# EAGLE design SingleNixie (EAGLE 7.4.0)
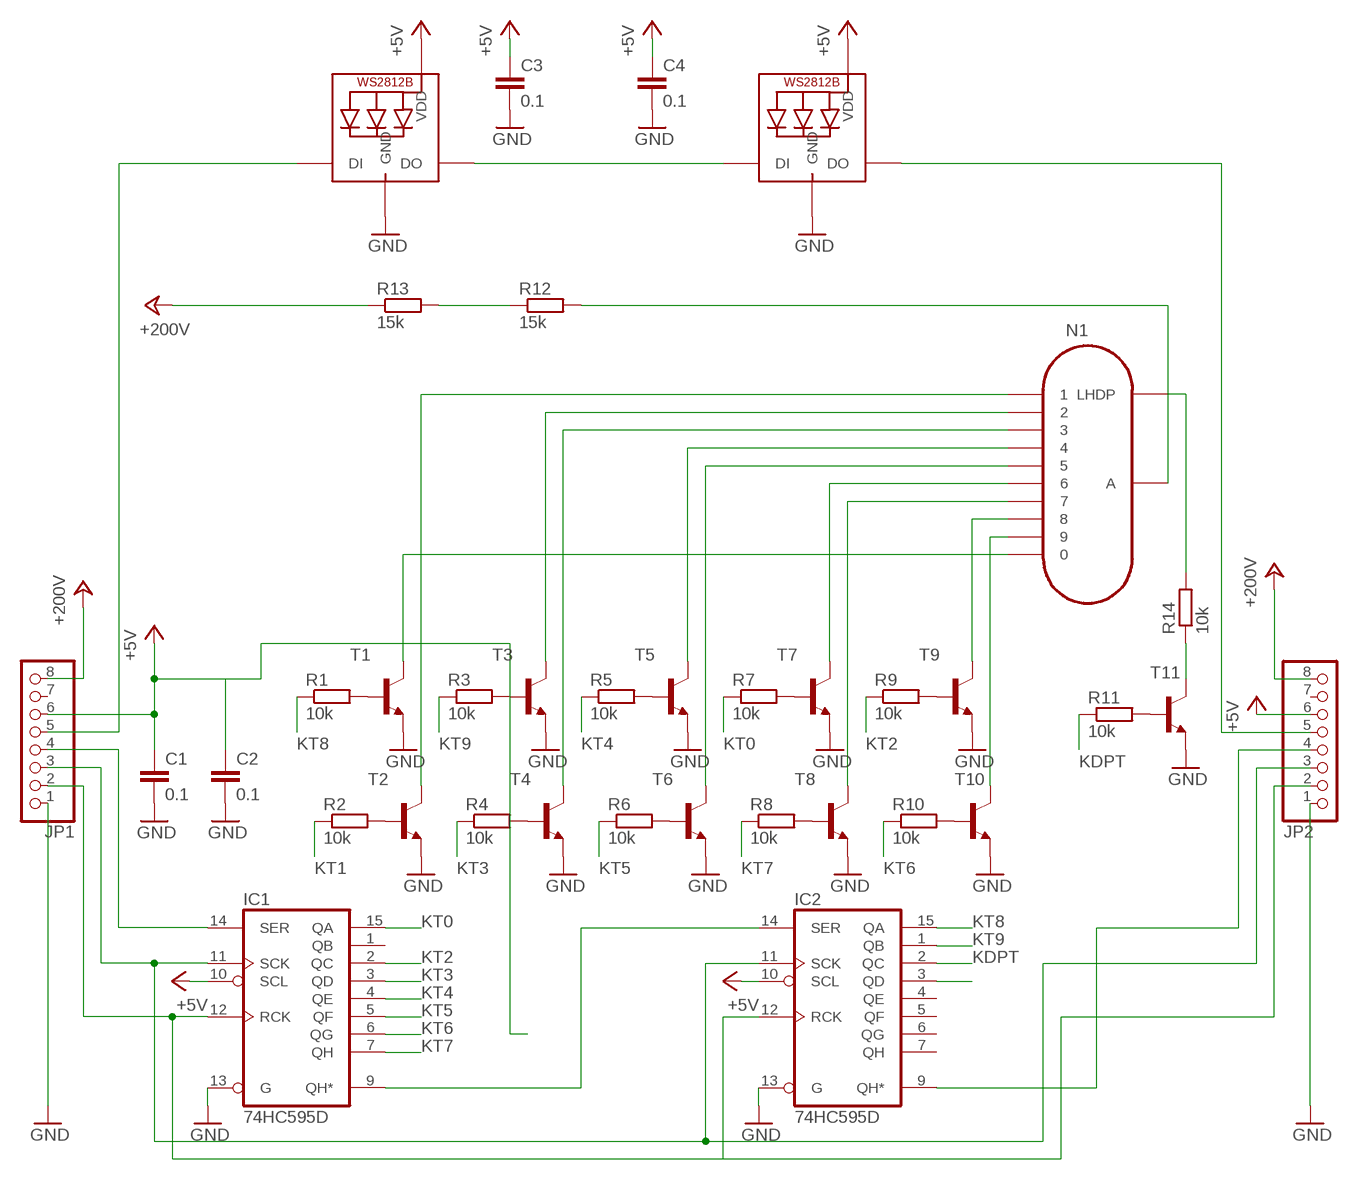
[diagram p0: schematic, sheet 1]

## Parts
C1  0.1  C-EUC0805  [C0805]
C2  0.1  C-EUC0805  [C0805]
C3  0.1  C-EUC0805  [C0805]
C4  0.1  C-EUC0805  [C0805]
IC1  74HC595D  [SO16]
IC2  74HC595D  [SO16]
JP1  HEADER-1X8ROUND  [1X08_ROUND]
JP2  HEADER-1X8ROUND  [1X08_ROUND]
LED1  WS2812B3535  [LED3535]
LED2  WS2812B3535  [LED3535]
N1  IN-12B1.5MM  [IN-12-1.5]
R1  10k  R-EU_R0805  [R0805]
R2  10k  R-EU_R0805  [R0805]
R3  10k  R-EU_R0805  [R0805]
R4  10k  R-EU_R0805  [R0805]
R5  10k  R-EU_R0805  [R0805]
R6  10k  R-EU_R0805  [R0805]
R7  10k  R-EU_R0805  [R0805]
R8  10k  R-EU_R0805  [R0805]
R9  10k  R-EU_R0805  [R0805]
R10  10k  R-EU_R0805  [R0805]
R11  10k  R-EU_R0805  [R0805]
R12  15k  R-EU_R0805  [R0805]
R13  15k  R-EU_R0805  [R0805]
R14  10k  R-EU_R0805  [R0805]
T1  MMBTA42LT1-NPN-SOT23-BEC  [SOT23-BEC]
T2  MMBTA42LT1-NPN-SOT23-BEC  [SOT23-BEC]
T3  MMBTA42LT1-NPN-SOT23-BEC  [SOT23-BEC]
T4  MMBTA42LT1-NPN-SOT23-BEC  [SOT23-BEC]
T5  MMBTA42LT1-NPN-SOT23-BEC  [SOT23-BEC]
T6  MMBTA42LT1-NPN-SOT23-BEC  [SOT23-BEC]
T7  MMBTA42LT1-NPN-SOT23-BEC  [SOT23-BEC]
T8  MMBTA42LT1-NPN-SOT23-BEC  [SOT23-BEC]
T9  MMBTA42LT1-NPN-SOT23-BEC  [SOT23-BEC]
T10  MMBTA42LT1-NPN-SOT23-BEC  [SOT23-BEC]
T11  MMBTA42LT1-NPN-SOT23-BEC  [SOT23-BEC]

## Nets
+5V: C1.1 C2.1 C3.1 C4.1 IC1.10(SCL) IC2.10(SCL) JP1.6 JP2.6 LED1.2(VDD) LED2.2(VDD)
+200V: JP1.8 JP2.8 R13.1
ANODE: N1.A R12.2
GND: C1.2 C2.2 C3.2 C4.2 IC1.13(G) IC2.13(G) JP1.1 JP2.1 LED1.4(GND) LED2.4(GND) T1.E T2.E T3.E T4.E T5.E T6.E T7.E T8.E T9.E T10.E T11.E
K0: N1.0 T1.C
K1: N1.1 T2.C
K2: N1.2 T3.C
K3: N1.3 T4.C
K4: N1.4 T5.C
K5: N1.5 T6.C
K6: N1.6 T7.C
K7: N1.7 T8.C
K8: N1.8 T9.C
K9: N1.9 T10.C
KDP: N1.LHDP R14.2
KDPT: IC2.2(QC) R11.1
KT0: IC1.15(QA) R7.1
KT1: IC2.3(QD) R2.1
KT2: IC1.2(QC) R9.1
KT3: IC1.3(QD) R4.1
KT4: IC1.4(QE) R5.1
KT5: IC1.5(QF) R6.1
KT6: IC1.6(QG) R10.1
KT7: IC1.7(QH) R8.1
KT8: IC2.15(QA) R1.1
KT9: IC2.1(QB) R3.1
N$1: R3.2 T3.B
N$2: R1.2 T1.B
N$3: R2.2 T2.B
N$4: R4.2 T4.B
N$5: R5.2 T5.B
N$6: R6.2 T6.B
N$7: R7.2 T7.B
N$8: R8.2 T8.B
N$9: R9.2 T9.B
N$10: R10.2 T10.B
N$11: LED1.3(DO) LED2.1(DI)
N$12: JP1.5 LED1.1(DI)
N$13: JP2.5 LED2.3(DO)
N$21: R11.2 T11.B
N$22: IC1.14(SER) JP1.4
N$23: R14.1 T11.C
N$24: R12.1 R13.2
N$25: IC1.9(QH*) IC2.14(SER)
N$26: IC1.11(SCK) IC2.11(SCK) JP1.3 JP2.3
N$27: IC1.12(RCK) IC2.12(RCK) JP1.2 JP2.2
N$28: IC2.9(QH*) JP2.4
Unconnected: IC1.1(QB) IC2.4(QE) IC2.5(QF) IC2.6(QG) IC2.7(QH) JP1.7 JP2.7

## Power pins joined to a net without a drawn wire
+5V: IC1.16(VCC) IC2.16(VCC)
GND: IC1.8(GND) IC2.8(GND)

## Library data of the parts
C1-C4 = rcl:C-EU: CAPACITOR, European symbol
IC1 IC2 = 74xx-eu:74*595: 8-bit SHIFT REGISTER, output latch
JP1 JP2 = Adafruit CP2104:HEADER-1X8: PIN HEADER
LED1 LED2 = adafruit:WS2812B
N1 = russian-nixies:IN-12B: IN-12B: medium numeric topview nixie tube
R1-R14 = resistor:R-EU_: RESISTOR, European symbol
T1-T11 = transistor-neu-to92:*-NPN-: NPN Transistror

## Board
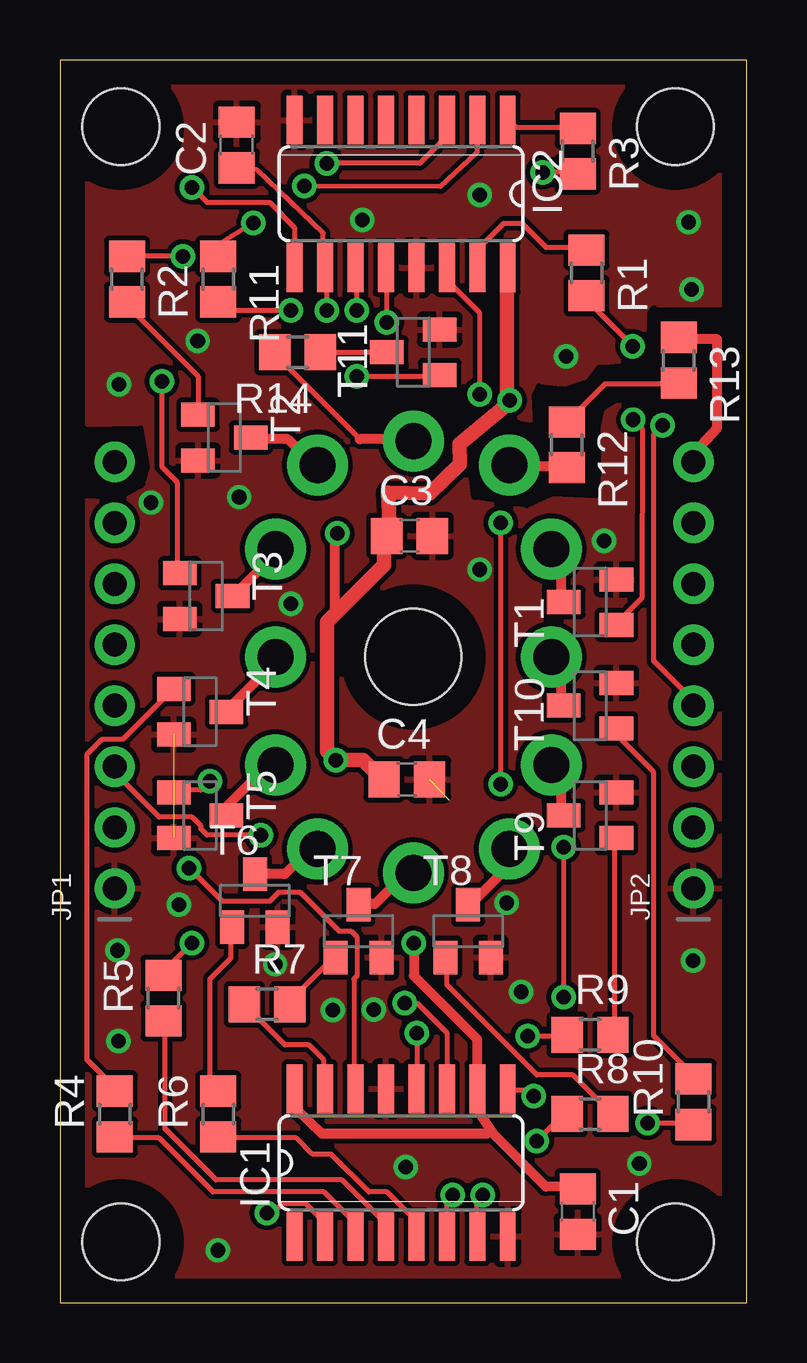
[diagram p1: board, top side]
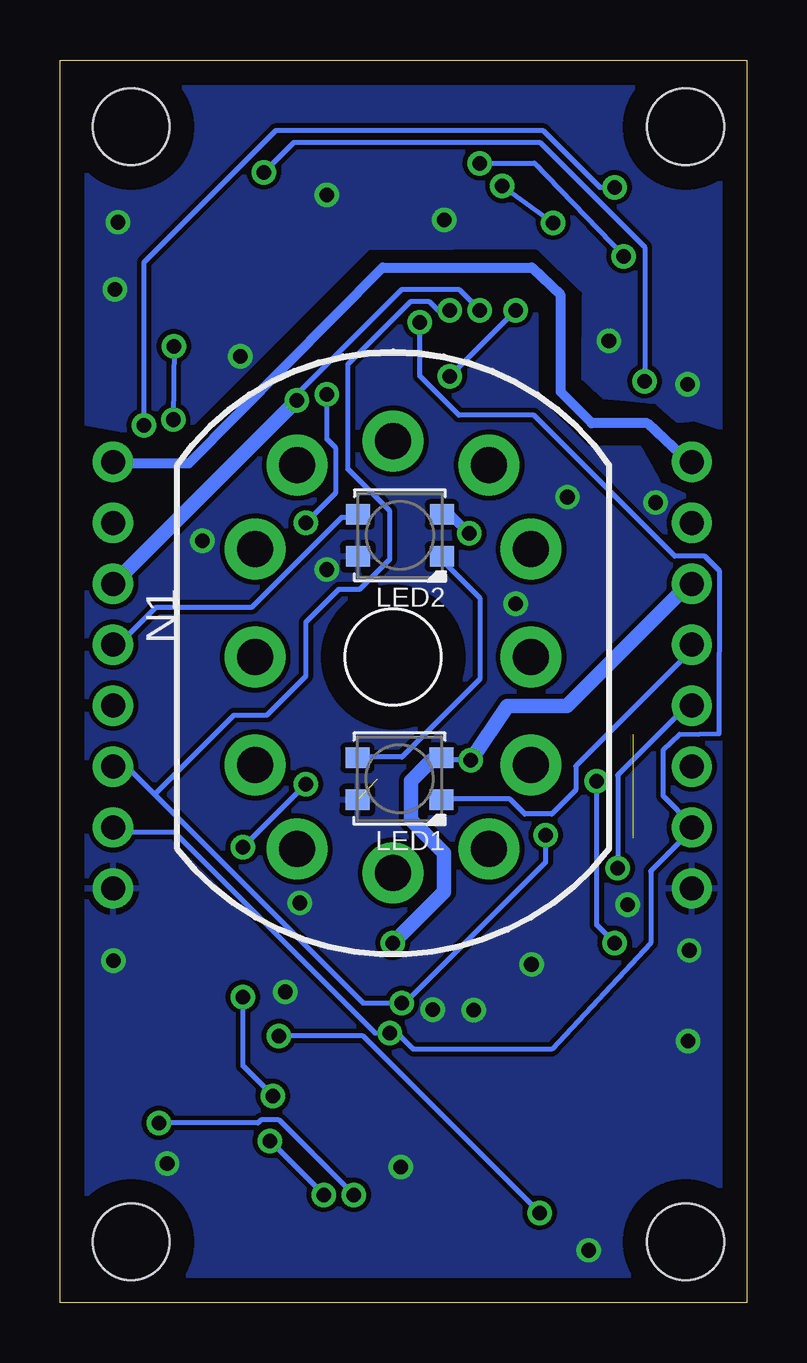
[diagram p2: board, bottom side, seen from below]

Size 28.63 x 51.81 mm. Coordinates in mm from the lower left corner, seen from the top.
Outline: 0,0 28.63,0 28.63,51.81 0,51.81 0,0
Copper layers (1*16): Top 0.035mm / dielectric 1.5mm / Bottom 0.035mm
Design rules "default *": minimum track width 8mil, minimum drill 24mil, track to track 8mil, track to pad 8mil, pad to pad 8mil, via to via 8mil, smd to smd 8mil, copper to edge 40mil, drill to drill 8mil, minimum pad ring 10mil, minimum via ring 8mil, stop-mask expansion 4mil, vias tented up to drill 0mil, thermal gap 10mil
Holes 3.2 mm at 2.54,2.54 25.65,2.54 25.65,49.02 2.54,49.02
tRestrict: area 17,33.2 to 27.6,41.5; area 0.8,33.6 to 3.6,36.4
bRestrict: area 0.8,33.7 to 27.6,43.8

### Footprints (pad centres in the part's own frame; a part is rotated, then mirrored left to right if it is on the bottom)
C0805 = smd 1.3 x 1.5: 1 -0.95,0; 2 0.95,0
SO16 = smd 0.66 x 2.032: 1 -4.445,-3.073; 2 -3.175,-3.073; 3 -1.905,-3.073; 4 -0.635,-3.073; 5 0.635,-3.073; 6 1.905,-3.073; 7 3.175,-3.073; 8 4.445,-3.073; 9 4.445,3.073; 10 3.175,3.073; 11 1.905,3.073; 12 0.635,3.073; 13 -0.635,3.073; 14 -1.905,3.073; 15 -3.175,3.073; 16 -4.445,3.073
1X08_ROUND = drill 1 pad 1.676: 1 -8.89,0; 2 -6.35,0; 3 -3.81,0; 4 -1.27,0; 5 1.27,0; 6 3.81,0; 7 6.35,0; 8 8.89,0
LED3535 = smd 1 x 0.85: 1 -1.75,0.875; 2 -1.75,-0.875; 3 1.75,-0.875; 4 1.75,0.875
IN-12-1.5 = drill 1.5 pad 2.54: 0 5.75,-4.5; 1 -4,-8; 2 -5.75,-4.5; 3 -5.75,0; 4 -5.75,4.5; 5 -4,8; 6 0,9; 7 4,8; 8 5.75,4.5; 9 5.75,0; A 4,-8; LHDP 0,-9 | hole 4: 0,0
R0805 = smd 1.3 x 1.5: 1 -0.95,0; 2 0.95,0
SOT23-BEC = smd 1 x 1.4: B -0.95,-1.1; C 0,1.1; E 0.95,-1.1

### Placement (x,y rotation side)
C1  21.59,3.81 270 top
C2  7.37,48.26 90 top
C3  14.57,31.97 0 top
C4  14.46,21.82 0 top
IC1  14.22,5.84 0 top
IC2  14.22,46.23 180 top
JP1  2.29,26.16 90 top
JP2  26.42,26.16 90 top
LED1  14.47,21.84 180 bottom
LED2  14.45,31.99 180 bottom
N1  14.73,26.92 180 bottom
R1  21.95,42.93 270 top
R2  2.79,42.67 270 top
R3  21.59,48.01 270 top
R4  2.29,7.87 90 top
R5  4.32,12.7 90 top
R6  6.6,7.87 90 top
R7  8.64,12.45 0 top
R8  22.1,7.87 0 top
R9  22.1,11.18 0 top
R10  26.42,8.38 90 top
R11  6.6,42.67 270 top
R12  21.13,35.76 270 top
R13  25.79,39.29 270 top
R14  9.91,39.62 180 top
T1  22.1,29.21 90 top
T2  6.86,36.07 270 top
T3  6.1,29.46 270 top
T4  5.84,24.64 270 top
T5  5.84,20.32 270 top
T6  8.13,16.76 0 top
T7  12.45,15.49 0 top
T8  17.02,15.49 0 top
T9  22.1,20.32 90 top
T10  22.1,24.89 90 top
T11  14.73,39.62 90 top

### Tracks (layer width: path | path; a pad name or v marks a point on that pad's centre or on a via)
+5V  (via drill 0.61)
  Top 0.203: C2.1 7.38,47.25 8.21,47.23 10.97,44.58 11,43.25 IC2.10 11.12,43.12 v11.12,41.38 | 13.62,32 13.75,32.12 13.49,32.07 C3.1 13.65,32.07 13.5,31.88 | 18.62,37.75 18.62,37.43 18.62,37.62 v18.75,37.62 | 18.62,43.12 IC2.16 | 21.5,4.88 C1.1 | 17.5,8.88 IC1.10 17.38,9 | 9.88,8.05 9.88,8.88 IC1.16 | 17.82,7.05 18.06,7.06 | 13.5,21.75 C4.1
  Top 0.406: 21.5,4.88 20.25,4.85 18.06,7.06 17.5,7.88 17.5,8.88 | 9.88,8.05 10.92,7.05 17.82,7.05 | 17.38,9 17.38,11 14.75,13.63 v14.75,15 | v11.57,32.07 11.44,31.95 11.44,28.69
  Top 0.61: 13.75,32.12 13.67,33.77 15.41,33.74 16.68,34.96 16.66,35.8 18.62,37.43 | 18.62,37.75 18.62,43.12 | 13.5,21.75 12.62,22.62 v11.5,22.62 11.12,23 11.12,28.38 11.44,28.69 13.5,30.75 13.5,31.88
  Bottom 0.203: 12.75,32.88 LED2.2 | 26.38,30 JP2.6 | v11.12,41.38 12,42.25 14.38,42.25 18.75,37.88 v18.75,37.62 | v11.5,22.62 12.62,22.62 LED1.2 12.75,22.62 13.12,22.62 | 2.38,30 JP1.6
  Bottom 0.406: v11.57,32.07 12.36,32.86 LED2.2
  Bottom 0.61: v18.75,37.62 26.38,30 | v11.5,22.62 9.97,24.88 7.5,24.88 2.38,30 | v14.75,15 12.62,17.12 12.62,18.75 14,20.12 14,21.75 13.12,22.62
+200V
  Top 0.203: 25.9,40.16 R13.1 | 26.5,35.12 JP2.8
  Top 0.406: 25.9,40.16 27.4,40.16 27.4,36.48 26.5,35.5 26.5,35.12
  Bottom 0.203: 2.38,35 JP1.8 | 26.38,35 JP2.8
  Bottom 0.406: 2.38,35 4.14,36.67 6.46,36.67 7.75,37.96 7.75,42 8.96,43.16 15.17,43.16 23.25,35 26.38,35
ANODE
  Top 0.203: 21.12,34.88 R12.2 | 18.75,34.88 N1.A
  Top 0.406: 18.75,34.88 21.12,34.88
GND  (via drill 0.61)  (2 unrouted)
  other vias: 14.41,5.65 13.08,12.23 11.38,12.2 8.97,14.11 4.95,16.6 2.44,10.91 2.39,14.69 6.58,2.19 24.16,5.8 19.23,12.96 18.62,16.67 26.39,14.26 21.11,39.46 26.21,45.04 26.34,42.25 7.47,33.59 9.63,29.14 2.46,38.29 5.74,40.09 22.68,31.76 17.5,30.57 12.6,45.14 17.5,46.19 3.79,33.36
  pour Bottom: 0.25,0.25 28.45,0.25 28.45,51.56 0.25,51.56
  pour Top: 0.47,0.49 28.18,0.65 28.25,51.3 0.38,51.37 0.36,0.72
K0
  Top 0.203: 20.88,29.25 T1.C | 20.5,31.38 N1.0
  Top 0.406: 20.88,29.25 20.88,31 20.5,31.38
K1
  Top 0.203: 8,36 T2.C | 10.62,34.88 N1.1
  Top 0.406: 8,36 9.5,36 10.62,34.88
K2
  Top 0.203: 7.25,29.5 T3.C | 8.88,31.38 N1.2
  Top 0.406: 7.25,29.5 8.88,31.12 8.88,31.38
K3
  Top 0.203: 7,24.75 T4.C | 8.88,26.88 N1.3
  Top 0.406: 7,24.75 8.88,26.62 8.88,26.88
K4
  Top 0.203: 7,20.75 7,20.38 T5.C | 8.88,22.38 N1.4
  Top 0.406: 7,20.75 8.62,22.38 8.88,22.38
K5
  Top 0.203: 10.62,18.88 10.38,18.88 | 8.25,17.88 T6.C
  Top 0.406: 8.25,17.88 9.38,17.88 10.38,18.88 | 10.62,18.88 N1.5
K6
  Top 0.203: 12.5,16.62 T7.C
  Top 0.406: 12.5,16.62 13.12,16.62 14.38,17.88 14.62,17.88 N1.6
K7
  Top 0.203: 17.12,16.62 T8.C | 18.62,18.88 N1.7
  Top 0.406: 17.12,16.62 18.62,18.12 18.62,18.88
K8
  Top 0.203: 20.88,20.38 T9.C | 20.5,22.38 N1.8
  Top 0.406: 20.88,20.38 20.88,22 20.5,22.38
K9
  Top 0.203: 20.88,25 T10.C | 20.5,26.88 N1.9
  Top 0.406: 20.88,25 20.88,26.5 20.5,26.88
KDP
  Top 0.203: 12.5,36 9,39.5 R14.2 | 14.62,36 N1.LHDP
  Top 0.406: 14.62,36 12.5,36
KDPT  (via drill 0.61)
  Top 0.203: v8.07,45.02 6.59,44.11 6.62,43.62 R11.1 | v10.19,46.55 15.87,46.53 17.38,47.94 17.38,49.25 IC2.2
  Bottom 0.203: v10.19,46.55 v8.07,45.02
KT0
  Top 0.203: R7.1 7.75,12.38 9.38,10.75 10.38,10.75 11,10.12 11,9 IC1.15
KT1  (via drill 0.61)
  Top 0.203: v5.12,43.62 2.88,43.62 R2.1 | v11.12,47.5 15,47.5 16.12,48.62 16.12,49.25 IC2.3
  Bottom 0.203: v5.12,43.62 8.85,47.51 v11.12,47.5
KT2  (via drill 0.61)
  Top 0.203: v19.5,11.12 21.12,11.12 R9.1 | v8.62,3.75 8.88,3.75 9.25,4.12 10.25,4.12 11,3.38 11,2.88 IC1.2
  Bottom 0.203: v19.5,11.12 16,11.12 v8.62,3.75
KT3
  Top 0.203: R4.1 2.38,6.88 4.12,6.88 6.38,4.62 11,4.62 12.25,3.38 12.25,2.88 IC1.3
KT4
  Top 0.203: R5.1 4.38,11.75 4.38,7.25 6.5,5.12 11.75,5.12 13.5,3.38 13.5,2.88 IC1.4
KT5
  Top 0.203: R6.1 6.62,6.88 9.86,6.88 10.54,6.2 11.3,6.2 12.88,4.62 13.62,4.62 14.75,3.5 14.75,2.88 IC1.5
KT6  (via drill 0.61)
  Top 0.203: v24.5,7.5 26.38,7.5 R10.1 | v16.38,4.5 16.12,4.25 16.12,2.88 IC1.6
  Bottom 0.203: v24.5,7.5 20.38,7.5 20.25,7.62 19.5,7.62 v16.38,4.5
KT7  (via drill 0.61)
  Top 0.203: v19.88,6.75 20.88,7.75 21.12,7.75 R8.1 | v17.62,4.5 17.38,4.25 17.38,2.88 IC1.7
  Bottom 0.203: v17.62,4.5 v19.88,6.75
KT8
  Top 0.203: R1.1 21.88,44 20.25,44 19.25,45 18.5,45 17.5,44 17.5,43.25 IC2.15
KT9
  Top 0.203: R3.1 21.5,49 19,49 18.75,49.25 IC2.1
N$1  (via drill 0.61)
  Top 0.203: v4.25,38.42 v4.24,38.42 4.24,34.85 4.88,34.21 4.88,30.5 T3.B | v20.12,47.12 21.5,47.12 R3.2
  Bottom 0.203: v4.25,38.42 4.25,44 8.62,48.38 18.88,48.38 v20.12,47.12
N$2  (via drill 0.61)
  Top 0.203: v23.9,36.81 24.27,36.44 24.25,29.38 23.25,28.38 T1.B | v23.88,39.88 21.88,41.88 R1.2
  Bottom 0.203: v23.88,39.88 v23.9,36.81
N$3
  Top 0.203: T2.B 5.75,37.12 5.75,38.62 2.75,41.62 R2.2
N$4
  Top 0.203: T4.B 4.62,25.5 2.62,23.5 1.75,23.5 1.12,22.88 1.12,10.12 2.38,8.88 R4.2
N$5  (via drill 0.61)
  Top 0.203: v6.25,21.75 5.88,21.38 4.75,21.38 T5.B | v5.5,15 4.25,13.75 R5.2
  Bottom 0.203: v6.25,21.75 6.25,15.75 v5.5,15
N$6
  Top 0.203: T6.B 7.12,15.62 7.12,14.38 6.25,13.5 6.25,9.12 6.5,8.88 R6.2
N$7
  Top 0.203: T7.B 11.38,14.38 9.5,12.5 R7.2
N$8
  Top 0.203: T8.B 16.12,14.38 16.12,13.25 19.88,9.5 21.38,9.5 23,7.88 R8.2
N$9
  Top 0.203: T9.B 23.12,19.25 23.12,11.25 R9.2
N$10
  Top 0.203: T10.B 23.25,23.88 23.25,23.62 24.75,22.12 24.75,11.12 26.5,9.38 R10.2
N$11
  Bottom 0.203: LED1.3 16.12,22.75 14.38,22.75 11.12,26 11.12,29.38 12.75,31 LED2.1
N$12
  Bottom 0.203: LED1.1 12.62,21 9.88,21 9.25,20.38 8.12,20.38 7.12,21.38 7.12,22.38 2.38,27.12 2.38,27.38 JP1.5
N$13
  Bottom 0.203: LED2.3 16.25,32.75 16.88,32.75 20.62,29 24.62,29 26.12,27.5 26.38,27.5 JP2.5
N$21  (via drill 0.61)
  Top 0.203: v12.38,38.62 15.75,38.62 T11.B | v9.62,41.38 6.88,41.38 6.62,41.62 R11.2
  Bottom 0.203: v9.62,41.38 v12.38,38.62
N$22  (via drill 0.61)
  Top 0.203: v5.38,18.12 6.75,16.75 8.75,16.75 9.12,17.12 10,17.12 11.62,15.5 12.12,15.5 12.38,15.25 12.38,13.62 12.25,13.5 12.25,9 IC1.14
  Bottom 0.203: v5.38,18.12 5.38,22 2.38,25 JP1.4
N$23
  Top 0.203: T11.C 10.88,39.62 R14.1
N$24
  Top 0.203: R12.1 22.72,38.3 25.74,38.3 25.76,37.88 25.75,37.86 R13.2
N$25  (via drill 0.61)
  Top 0.203: v17.5,37.88 17.5,41.25 16.25,42.5 16.25,43.12 IC2.14 | v18.38,21.62 v18.38,32.52 | v21,12.75 v21,19 | v19.75,8.62 19.5,8.88 18.75,8.88 IC1.9
  Bottom 0.203: v17.5,37.88 17.5,36 17.12,35.62 17.12,33.77 v18.38,32.52 | v21,19 v18.38,21.62 | v21,12.75 21,9.88 v19.75,8.62
N$26  (via drill 0.61)
  Top 0.203: v14.38,12.5 14.88,12.5 16.12,11.25 16.12,9 IC1.11 | v12.38,41.38 12.38,43.12 IC2.11 | v8.38,19.5 6.12,19.5 5.88,19.75 5.88,19.88 5.5,20.25 4.12,20.25 2.38,22 2.38,22.25 JP1.3
  Bottom 0.203: 24.69,21.19 25.75,22.25 26.38,22.25 JP2.3 | 24.69,21.19 16,12.5 v14.38,12.5 14.25,12.5 8.38,18.38 v8.38,19.5 | v12.38,41.38 12.88,41.38 13.25,41.75 14,41.75 16.62,39.12 16.62,34.75 14.88,33 14.88,31 16.12,29.75 17,29.75 18.38,28.38 18.38,26.12 20,24.5 21.38,24.5 24.69,21.19
N$27  (via drill 0.61)
  Top 0.203: v14.88,11.25 14.88,9 IC1.12 | v13.62,40.88 13.62,43.12 IC2.12
  Bottom 0.203: JP2.2 26.38,19.75 26.25,19.62 23.88,19.62 15.5,11.25 v14.88,11.25 14.58,11.25 13.89,10.57 8.12,10.57 4,15 4,18 2.25,19.75 JP1.2 2.25,19.88 3.48,21.13 3.46,23.06 2.79,23.7 1.14,23.72 1.12,30.5 1.75,31.12 3,31.12 8.88,37 12,37 13.62,38.62 v13.62,40.88
N$28  (via drill 0.61)
  Top 0.203: v5.5,46.5 6.12,45.88 8.74,45.88 9.78,44.81 9.75,43.25 IC2.9 | v25.12,36.58 24.75,36.21 24.75,26.75 26.5,25 JP2.4
  Bottom 0.203: v5.5,46.5 6.12,46.5 8.5,48.88 19.62,48.88 25.12,43.38 v25.12,36.58